# EAGLE design interface (EAGLE 9.4.2)
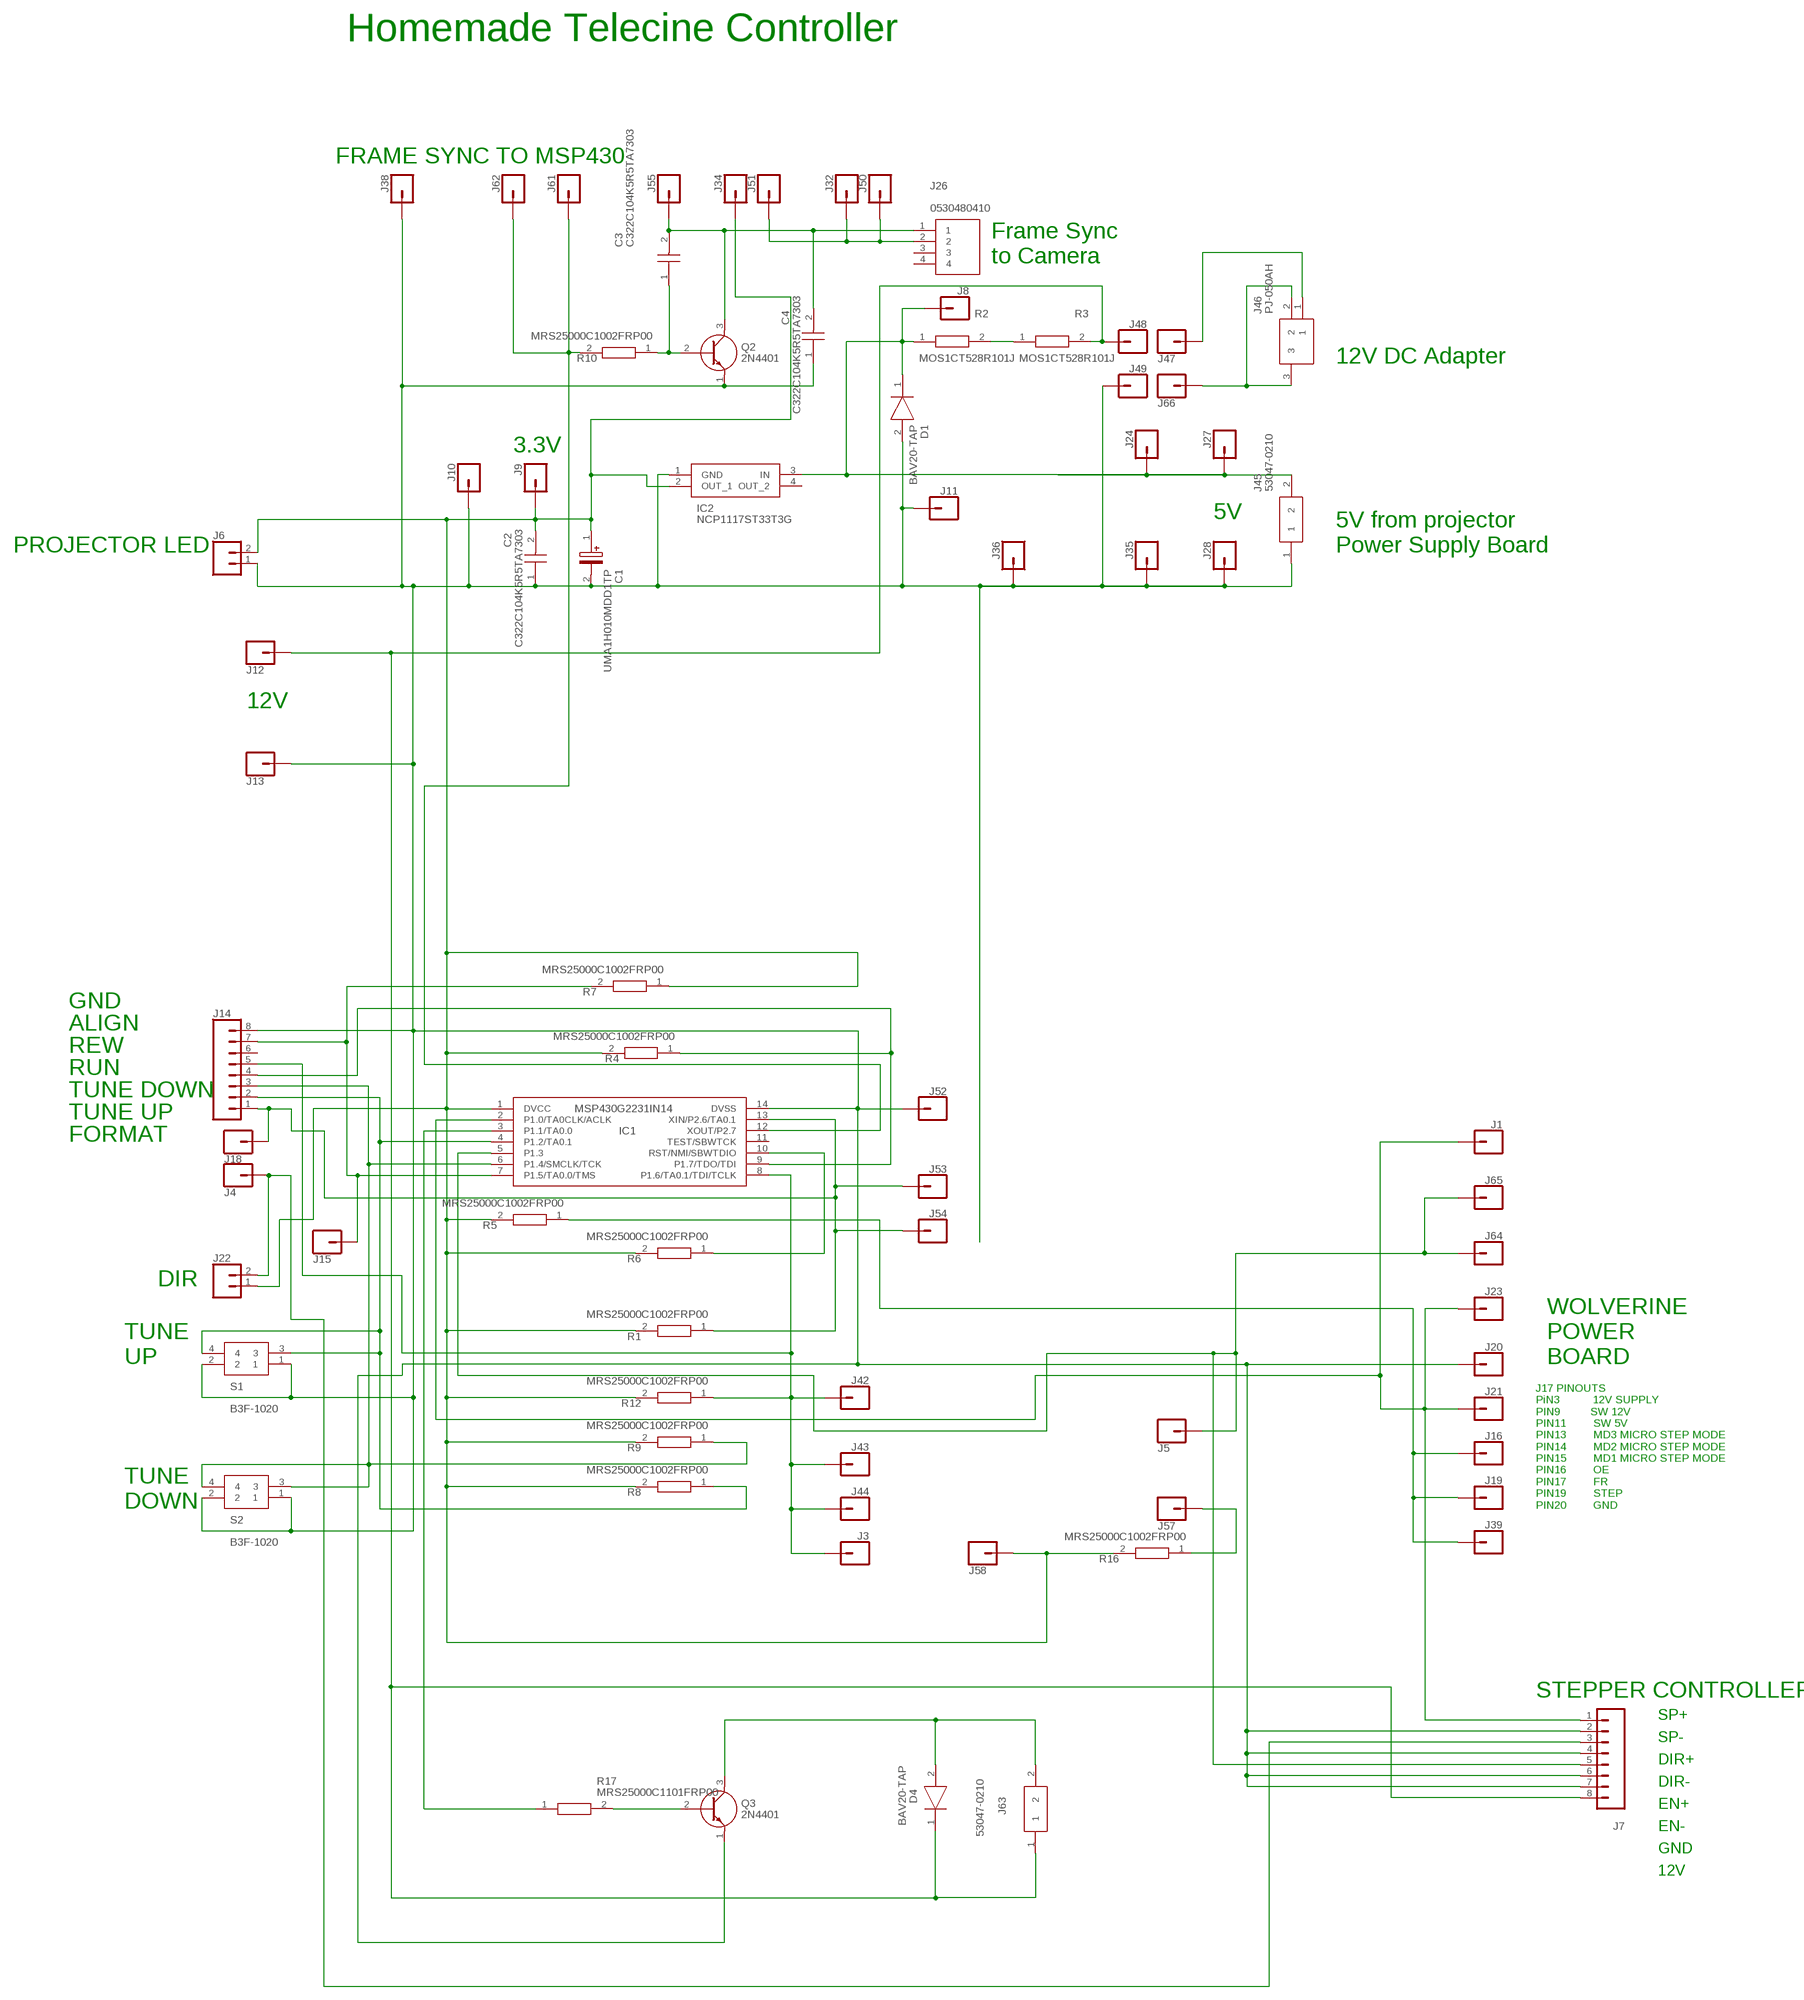
[diagram p0: schematic, sheet 1]

## Parts
C1  UMA1H010MDD1TP  [CAPPRD150W45D450H600]
C2  C322C104K5R5TA7303  [C322]
C3  C322C104K5R5TA7303  [C322]
C4  C322C104K5R5TA7303  [C322]
D1  BAV20-TAP  [DIOAD950W60L350D150]
D4  BAV20-TAP  [DIOAD950W60L350D150]
IC1  MSP430G2231IN14  [DIP254P762X508-14]
IC2  NCP1117ST33T3G  [SOT230P700X180-4N]
J1  CONN_01  [1X01]
J3  CONN_01  [1X01]
J4  CONN_01  [1X01]
J5  CONN_01  [1X01]
J6  CONN_02  [1X02]
J7  CONN_08"  [1X08]
J8  CONN_01  [1X01]
J9  CONN_01  [1X01]
J10  CONN_01  [1X01]
J11  CONN_01  [1X01]
J12  CONN_01  [1X01]
J13  CONN_01  [1X01]
J14  CONN_08"  [1X08]
J15  CONN_01  [1X01]
J16  CONN_01  [1X01]
J18  CONN_01  [1X01]
J19  CONN_01  [1X01]
J20  CONN_01  [1X01]
J21  CONN_01  [1X01]
J22  CONN_02  [1X02]
J23  CONN_01  [1X01]
J24  CONN_01  [1X01]
J26  0530480410  [SHDR4W35P0X125_1X4_675X550X350]
J27  CONN_01  [1X01]
J28  CONN_01  [1X01]
J32  CONN_01  [1X01]
J34  CONN_01  [1X01]
J35  CONN_01  [1X01]
J36  CONN_01  [1X01]
J38  CONN_01  [1X01]
J39  CONN_01  [1X01]
J42  CONN_01  [1X01]
J43  CONN_01  [1X01]
J44  CONN_01  [1X01]
J45  53047-0210  [53047-0210]
J46  PJ-050AH  [PJ050AH]
J47  CONN_01  [1X01]
J48  CONN_01  [1X01]
J49  CONN_01  [1X01]
J50  CONN_01  [1X01]
J51  CONN_01  [1X01]
J52  CONN_01  [1X01]
J53  CONN_01  [1X01]
J54  CONN_01  [1X01]
J55  CONN_01  [1X01]
J57  CONN_01  [1X01]
J58  CONN_01  [1X01]
J61  CONN_01  [1X01]
J62  CONN_01  [1X01]
J63  53047-0210  [53047-0210]
J64  CONN_01  [1X01]
J65  CONN_01  [1X01]
J66  CONN_01  [1X01]
Q2  2N4401  [CS_TO-92]
Q3  2N4401  [CS_TO-92]
R1  MRS25000C1002FRP00  [RESAD1650W60L650D250]
R2  MOS1CT528R101J  [RESAD2100W60L900D300]
R3  MOS1CT528R101J  [RESAD2100W60L900D300]
R4  MRS25000C1002FRP00  [RESAD1650W60L650D250]
R5  MRS25000C1002FRP00  [RESAD1650W60L650D250]
R6  MRS25000C1002FRP00  [RESAD1650W60L650D250]
R7  MRS25000C1002FRP00  [RESAD1650W60L650D250]
R8  MRS25000C1002FRP00  [RESAD1650W60L650D250]
R9  MRS25000C1002FRP00  [RESAD1650W60L650D250]
R10  MRS25000C1002FRP00  [RESAD1650W60L650D250]
R12  MRS25000C1002FRP00  [RESAD1650W60L650D250]
R16  MRS25000C1002FRP00  [RESAD1650W60L650D250]
R17  MRS25000C1101FRP00  [RESAD1650W60L650D250]
S1  B3F-1020  [B3F1000]
S2  B3F-1020  [B3F1000]

## Nets
N$1: C3.2 C4.2 J26.1 J55.1 Q2.3(C)
N$2: IC1.13(XIN/P2.6/TA0.1) J14.1 J18.1 J53.1 J54.1 R1.1
N$3: D4.1(K) J7.8 J12.1 J48.1 J63.1 R3.2
N$4: IC1.9(P1.7/TDO/TDI) J14.4 R4.1
N$5: J57.1 R16.1
N$6: C1.1(+) C2.2 IC1.1(DVCC) IC2.2(OUT_1) J6.2 J9.1 J22.1 J34.1 J58.1 R1.2 R4.2 R5.2 R6.2 R7.1 R8.2 R9.2 R12.2 R16.2
N$7: IC1.3(P1.1/TA0.0) R17.1
N$8: IC1.10(RST/NMI/SBWTDIO) R6.1
N$9: R2.2 R3.1
N$10: J4.1 J7.3 J22.2
N$11: D1.1(K) IC2.3(IN) J8.1 J24.1 J27.1 J45.2 R2.1
N$12: J46.1 J47.1
N$13: IC1.7(P1.5/TA0.0/TMS) J14.7 J15.1 R7.2
N$14: J16.1 J19.1 J39.1 R5.1
N$15: IC1.5(P1.3) J5.1 J7.5 J64.1 J65.1
N$16: IC1.2(P1.0/TA0CLK/ACLK) J1.1 J7.1 J21.1 J23.1
N$17: IC1.4(P1.2/TA0.1) J14.2 R8.1 S1.3 S1.4
N$19: C1.2(-) C2.1 C4.1 D1.2(A) IC1.14(DVSS) IC2.1(GND) J6.1 J7.2 J7.4 J7.6 J7.7 J10.1 J11.1 J13.1 J14.8 J20.1 J28.1 J35.1 J36.1 J38.1 J45.1 J49.1 J52.1 Q2.1(E) Q3.1(E) S1.1 S1.2 S2.1 S2.2
N$21: IC1.6(P1.4/SMCLK/TCK) J14.3 R9.1 S2.3 S2.4
N$22: IC1.12(XOUT/P2.7) J61.1 J62.1 R10.2
N$25: Q3.2(B) R17.2
N$27: C3.1 Q2.2(B) R10.1
N$28: J26.2 J32.1 J50.1 J51.1
N$30: IC1.8(P1.6/TA0.1/TDI/TCLK) J3.1 J14.5 J42.1 J43.1 J44.1 R12.1
N$31: J46.2 J46.3 J66.1
N$36: D4.2(A) J63.2 Q3.3(C)
Unconnected: IC1.11(TEST/SBWTCK) IC2.4(OUT_2) J14.6 J26.3 J26.4

## Notes on the sheet
- Homemade Telecine Controller
- FRAME SYNC TO MSP430
- Frame Sync 
  to Camera
- 12V DC Adapter
- 3.3V
- 5V
- PROJECTOR LED
- 5V from projector
  Power Supply Board
- 12V
- GND
- ALIGN
- REW
- RUN
- TUNE DOWN
- TUNE UP
- FORMAT
- DIR
- TUNE
  UP
- WOLVERINE
  POWER
  BOARD
- TUNE
  DOWN
- J17 PINOUTS
  PiN3           12V SUPPLY
  PIN9          SW 12V
  PIN11         SW 5V
  PIN13         MD3 MICRO STEP MODE         
  PIN14         MD2 MICRO STEP MODE
  PIN15         MD1 MICRO STEP MODE
  PIN16         OE
  PIN17         FR
  PIN19         STEP
  PIN20         GND
- STEPPER CONTROLLER
- SP+
- SP-
- DIR+
- DIR-
- EN+
- EN-
- GND
- 12V

## Library data of the parts
C1 = UMA1H010MDD1TP:UMA1H010MDD1TP: Aluminum Electrolytic Capacitors - Leaded 1uF 50 Volts 20% Source: Datasheet <https://www.mouser.com/ds/2/293/e-uma-1218975.pdf>; ALLIED_NUMBER: E4769760; ALLIED_PRICE-STOCK: https://www.alliedelec.com/nichicon-uma1h010mdd1tp/E4769760/; DESCRIPTION: Aluminum Electrolytic Capacitors - Leaded 1uF 50 Volts 20%; HEIGHT: 6mm; MANUFACTURER_NAME: Nichicon; MANUFACTURER_PART_NUMBER: UMA1H010MDD1TP; MOUSER_PART_NUMBER: 647-UMA1H010MDD1TP; MOUSER_PRICE-STOCK: https://www.mouser.com/Search/Refine.aspx?Keyword=647-UMA1H010MDD1TP
C2-C4 = C322C104K5R5TA7303:C322C104K5R5TA7303: Multilayer Ceramic Capacitors MLCC - Leaded 50volts 0.1uF 10% X7R Source: Datasheet <https://content.kemet.com/datasheets/KEM_C1050_GOLDMAX_X7R.pdf>; DESCRIPTION: Multilayer Ceramic Capacitors MLCC - Leaded 50volts 0.1uF 10% X7R; HEIGHT: mm; MANUFACTURER_NAME: Kemet; MANUFACTURER_PART_NUMBER: C322C104K5R5TA7303; MOUSER_PART_NUMBER: 80-C322C104K5R7303; MOUSER_PRICE-STOCK: https://www.mouser.com/Search/Refine.aspx?Keyword=80-C322C104K5R7303
D1 D4 = BAV20-TAP:BAV20-TAP: Diode Switching 200V 0.25A Vishay BAV20-TAP Switching Diode, 250mA 200V, 2-Pin DO-35 Source: Datasheet <https://componentsearchengine.com/Datasheets/1/BAV20-TAP.pdf>; DESCRIPTION: Diode Switching 200V 0.25A Vishay BAV20-TAP Switching Diode, 250mA 200V, 2-Pin DO-35; HEIGHT: mm; MANUFACTURER_NAME: Vishay; MANUFACTURER_PART_NUMBER: BAV20-TAP; MOUSER_PART_NUMBER: 78-BAV20-TAP; MOUSER_PRICE-STOCK: https://www.mouser.com/Search/Refine.aspx?Keyword=78-BAV20-TAP
IC1 = MSP430G2231IN14:MSP430G2231IN14: MSP430G2x21, MSP430G2x31 Mixed Signal Microcontroller Source: Datasheet <http://www.ti.com/lit/gpn/msp430g2231>; DESCRIPTION: MSP430G2x21, MSP430G2x31 Mixed Signal Microcontroller; HEIGHT: mm; MANUFACTURER_NAME: Texas Instruments; MANUFACTURER_PART_NUMBER: MSP430G2231IN14; MOUSER_PART_NUMBER: 595-MSP430G2231IN14; MOUSER_PRICE-STOCK: https://www.mouser.com/Search/Refine.aspx?Keyword=595-MSP430G2231IN14; RS_PART_NUMBER: 7244654P; RS_PRICE-STOCK: http://uk.rs-online.com/web/p/products/7244654P
IC2 = NCP1117ST33T3G:NCP1117ST33T3G: ON SEMICONDUCTOR - NCP1117ST33T3G - IC, LINEAR VOLTAGE REGULATOR Source: Datasheet <https://componentsearchengine.com/Datasheets/1/NCP1117ST33T3G.pdf>; DESCRIPTION: ON SEMICONDUCTOR - NCP1117ST33T3G - IC, LINEAR VOLTAGE REGULATOR; HEIGHT: 1.8mm; MANUFACTURER_NAME: ON Semiconductor; MANUFACTURER_PART_NUMBER: NCP1117ST33T3G; MOUSER_PART_NUMBER: 863-NCP1117ST33T3G; MOUSER_PRICE-STOCK: https://www.mouser.com/Search/Refine.aspx?Keyword=863-NCP1117ST33T3G
J1 J3-J5 J8-J13 J15 J16 J18-J21 J23 J24 J27 J28 J32 J34-J36 J38 J39 J42-J44 J47-J55 J57 J58 J61 J62 J64-J66 = SparkFun-Connectors:CONN_01: Single connection point. Often used as Generic Header-pin footprint for 0.1 inch spaced/style header connections On any of the 0.1 inch spaced packages, you can populate with these: Break Away Headers - Straight <https://www.sparkfun.com/products/116> (PRT-00116) Break Away Male Headers - Right Angle <https://www.sparkfun.com/products/553> (PRT-00553) Female Headers <https://www.sparkfun.com/products/115> (PRT-00115) Break Away Headers - Machine Pin <https://www.sparkfun.com/products/117> (PRT-00117) Break Away Female Headers - Swiss Machine Pin <https://www.sparkfun.com/products/743> (PRT-00743) This device is also useful as a general connection point to wire up your design to another part of your project. Our various solder wires solder well into these plated through hole pads. Hook-Up Wire - Assortment (Stranded, 22 AWG) <https://www.sparkfun.com/products/11375> (PRT-11375) Hook-Up Wire - Assortment (Solid Core, 22 AWG) <https://www.sparkfun.com/products/11367> (PRT-11367) View the entire wire category on our website here <https://www.sparkfun.com/categories/141> Special notes: SMTSO-256-ET is a "flush mount" nut for a 4-40 screw. We mostly use this on specialty testbeds; it is a nice way to connect hardware to your PCB at an adjustable hieght. Also note, the SNAP packages are for using a snappable style connector. We sell a baggie of snaps and they are also used on two LilyPad designs: Snap Assortment - 30 pack (male and female) <https://www.sparkfun.com/products/11347> (DEV-11347) LilyPad Arduino SimpleSnap <https://www.sparkfun.com/products/10941> (DEV-10941) LilyPad SimpleSnap Protoboard <https://www.sparkfun.com/products/10940> (DEV-10940)
J6 J22 = SparkFun-Connectors:CONN_02: Multi connection point. Often used as Generic Header-pin footprint for 0.1 inch spaced/style header connections On any of the 0.1 inch spaced packages, you can populate with these: Break Away Headers - Straight <https://www.sparkfun.com/products/116> (PRT-00116) Break Away Male Headers - Right Angle <https://www.sparkfun.com/products/553> (PRT-00553) Female Headers <https://www.sparkfun.com/products/115> (PRT-00115) Break Away Headers - Machine Pin <https://www.sparkfun.com/products/117> (PRT-00117) Break Away Female Headers - Swiss Machine Pin <https://www.sparkfun.com/products/743> (PRT-00743) For SCREWTERMINALS and SPRING TERMINALS visit here: Screw Terimnals on SparkFun.com <https://www.sparkfun.com/search/results?term=Screw+Terminals> (5mm/3.5mm/2.54mm spacing) This device is also useful as a general connection point to wire up your design to another part of your project. Our various solder wires solder well into these plated through hole pads. Hook-Up Wire - Assortment (Stranded, 22 AWG) <https://www.sparkfun.com/products/11375> (PRT-11375) Hook-Up Wire - Assortment (Solid Core, 22 AWG) <https://www.sparkfun.com/products/11367> (PRT-11367) View the entire wire category on our website here <https://www.sparkfun.com/categories/141> Special notes: Molex polarized connector foot print use with: PRT-08233 with associated crimp pins and housings. 2.54_SCREWTERM for use with PRT-10571. 3.5mm Screw Terminal footprints for PRT-08084 5mm Screw Terminal footprints for use with PRT-08432
J7 J14 = SparkFun-Connectors:CONN_08: Multi connection point. Often used as Generic Header-pin footprint for 0.1 inch spaced/style header connections On any of the 0.1 inch spaced packages, you can populate with these: Break Away Headers - Straight <https://www.sparkfun.com/products/116> (PRT-00116) Break Away Male Headers - Right Angle <https://www.sparkfun.com/products/553> (PRT-00553) Female Headers <https://www.sparkfun.com/products/115> (PRT-00115) Break Away Headers - Machine Pin <https://www.sparkfun.com/products/117> (PRT-00117) Break Away Female Headers - Swiss Machine Pin <https://www.sparkfun.com/products/743> (PRT-00743) Arduino Stackable Header - 8 Pin <https://www.sparkfun.com/products/9279> (PRT-09279) For SCREWTERMINALS and SPRING TERMINALS visit here: Screw Terimnals on SparkFun.com <https://www.sparkfun.com/search/results?term=Screw+Terminals> (5mm/3.5mm/2.54mm spacing) This device is also useful as a general connection point to wire up your design to another part of your project. Our various solder wires solder well into these plated through hole pads. Hook-Up Wire - Assortment (Stranded, 22 AWG) <https://www.sparkfun.com/products/11375> (PRT-11375) Hook-Up Wire - Assortment (Solid Core, 22 AWG) <https://www.sparkfun.com/products/11367> (PRT-11367) View the entire wire category on our website here <https://www.sparkfun.com/categories/141> Special notes: Molex polarized connector foot print use with SKU : PRT-08231 with associated crimp pins and housings. 1MM SMD Version SKU: PRT-10208 NOTES ON THE VARIANTS LOCK and LOCK_LONGPADS... This footprint was designed to help hold the alignment of a through-hole component (i.e. 6-pin header) while soldering it into place. You may notice that each hole has been shifted either up or down by 0.005 of an inch from it's more standard position (which is a perfectly straight line). This slight alteration caused the pins (the squares in the middle) to touch the edges of the holes. Because they are alternating, it causes a "brace" to hold the component in place. 0.005 has proven to be the perfect amount of "off-center" position when using our standard breakaway headers. Although looks a little odd when you look at the bare footprint, once you have a header in there, the alteration is very hard to notice. Also,if you push a header all the way into place, it is covered up entirely on the bottom side.; PROD_ID: CONN-08438
J26 = 0530480410:0530480410: MOLEX - 0530480410 - PicoBlade WIRE-BOARD CONNECTOR HEADER 4 POSITION, 1.25MM Source: Datasheet <https://www.arrow.com/en/products/0530480410/molex>; ARROW_PART_NUMBER: 0530480410; ARROW_PRICE-STOCK: https://www.arrow.com/en/products/0530480410/molex; DESCRIPTION: MOLEX - 0530480410 - PicoBlade WIRE-BOARD CONNECTOR HEADER 4 POSITION, 1.25MM; HEIGHT: 3.5mm; MANUFACTURER_NAME: Molex; MANUFACTURER_PART_NUMBER: 0530480410
J45 J63 = 53047-0210:53047-0210: 2 way through board PCB straight header Molex PICOBLADE Series, Series Number 53047, 1.25mm Pitch 2 Way 1 Row Straight PCB Header, Solder Termination, 1A Source: Datasheet <http://uk.rs-online.com/web/p/products/2799213P>; DESCRIPTION: 2 way through board PCB straight header Molex PICOBLADE Series, Series Number 53047, 1.25mm Pitch 2 Way 1 Row Straight PCB Header, Solder Termination, 1A; HEIGHT: mm; MANUFACTURER_NAME: Molex; MANUFACTURER_PART_NUMBER: 53047-0210; RS_PART_NUMBER: 2799213P; RS_PRICE-STOCK: http://uk.rs-online.com/web/p/products/2799213P
J46 = PJ-050AH:PJ-050AH: DC Power Connectors Power Jacks Source: Datasheet <https://www.cui.com/product/resource/pj-050ah.pdf>; ARROW_PART_NUMBER: PJ-050AH; ARROW_PRICE-STOCK: https://www.arrow.com/en/products/pj-050ah/cui-devices; DESCRIPTION: DC Power Connectors Power Jacks; HEIGHT: 11mm; MANUFACTURER_NAME: CUI Inc.; MANUFACTURER_PART_NUMBER: PJ-050AH; MOUSER_PART_NUMBER: 490-PJ-050AH; MOUSER_PRICE-STOCK: https://www.mouser.co.uk/ProductDetail/CUI-Devices/PJ-050AH?qs=WyjlAZoYn50PwROH2sG8CQ%3D%3D
Q2 Q3 = 2N4401:2N4401: Bipolar Transistors - BJT NPN Gen Pur SS Source: Datasheet <https://my.centralsemi.com/get_document.php?cmp=1&mergetype=pd&mergepath=pd&pdf_id=2N4400.PDF>; DESCRIPTION: Bipolar Transistors - BJT NPN Gen Pur SS; HEIGHT: mm; MANUFACTURER_NAME: Central Semiconductor; MANUFACTURER_PART_NUMBER: 2N4401; MOUSER_PART_NUMBER: 610-2N4401; MOUSER_PRICE-STOCK: https://www.mouser.com/Search/Refine.aspx?Keyword=610-2N4401
R1 R4-R10 R12 R16 = SamacSys_Parts:MRS25000C1002FRP00: Vishay MRS25 Series RP Axial Metal Film Resistor 10k +/-1% 0.6W +/-50ppm/K Source: Datasheet <https://componentsearchengine.com/Datasheets/1/MRS25000C1002FRP00.pdf>; DESCRIPTION: Vishay MRS25 Series RP Axial Metal Film Resistor 10k +/-1% 0.6W +/-50ppm/K; HEIGHT: mm; MANUFACTURER_NAME: Vishay; MANUFACTURER_PART_NUMBER: MRS25000C1002FRP00; MOUSER_PART_NUMBER: 594-MRS2510K00F; MOUSER_PRICE-STOCK: https://www.mouser.com/Search/Refine.aspx?Keyword=594-MRS2510K00F
R2 R3 = SamacSys_Parts:MOS1CT528R101J: Metal Oxide Resistors 100 ohm 5% 1W Source: Datasheet <https://componentsearchengine.com/Datasheets/1/MOS1CT528R101J.pdf>; DESCRIPTION: Metal Oxide Resistors 100 ohm 5% 1W; HEIGHT: mm; MANUFACTURER_NAME: KOA Speer; MANUFACTURER_PART_NUMBER: MOS1CT528R101J; MOUSER_PART_NUMBER: 660-MOS1CT528R101J; MOUSER_PRICE-STOCK: https://www.mouser.com/Search/Refine.aspx?Keyword=660-MOS1CT528R101J
R17 = MRS25000C1101FRP00:MRS25000C1101FRP00: Vishay MRS2500 Series Axial Metal Film Resistor 1.1k +/-1% 0.6W +/-50ppm/K Source: Datasheet <https://componentsearchengine.com/Datasheets/1/MRS25000C1101FRP00.pdf>; DESCRIPTION: Vishay MRS2500 Series Axial Metal Film Resistor 1.1k +/-1% 0.6W +/-50ppm/K; HEIGHT: mm; MANUFACTURER_NAME: Vishay; MANUFACTURER_PART_NUMBER: MRS25000C1101FRP00; MOUSER_PART_NUMBER: 594-MRS25000C1101FRP; MOUSER_PRICE-STOCK: https://www.mouser.com/Search/Refine.aspx?Keyword=594-MRS25000C1101FRP
S1 S2 = B3F-1020:B3F-1020: Switch Tact SPST,flat 5mm act,PC Pins Black Plunger Tactile Switch, SPST-NO 0.05 A@ 24 V dc 0.9mm Source: Datasheet <http://www.omron.com/ecb/products/pdf/en-b3f.pdf>; DESCRIPTION: Switch Tact SPST,flat 5mm act,PC Pins Black Plunger Tactile Switch, SPST-NO 0.05 A@ 24 V dc 0.9mm; HEIGHT: mm; MANUFACTURER_NAME: Omron Electronics; MANUFACTURER_PART_NUMBER: B3F-1020; MOUSER_PART_NUMBER: 653-B3F-1020; MOUSER_PRICE-STOCK: https://www.mouser.co.uk/ProductDetail/Omron-Electronics/B3F-1020?qs=lK7M36XCk6J1%2FfWxwEHrqA%3D%3D

## Board
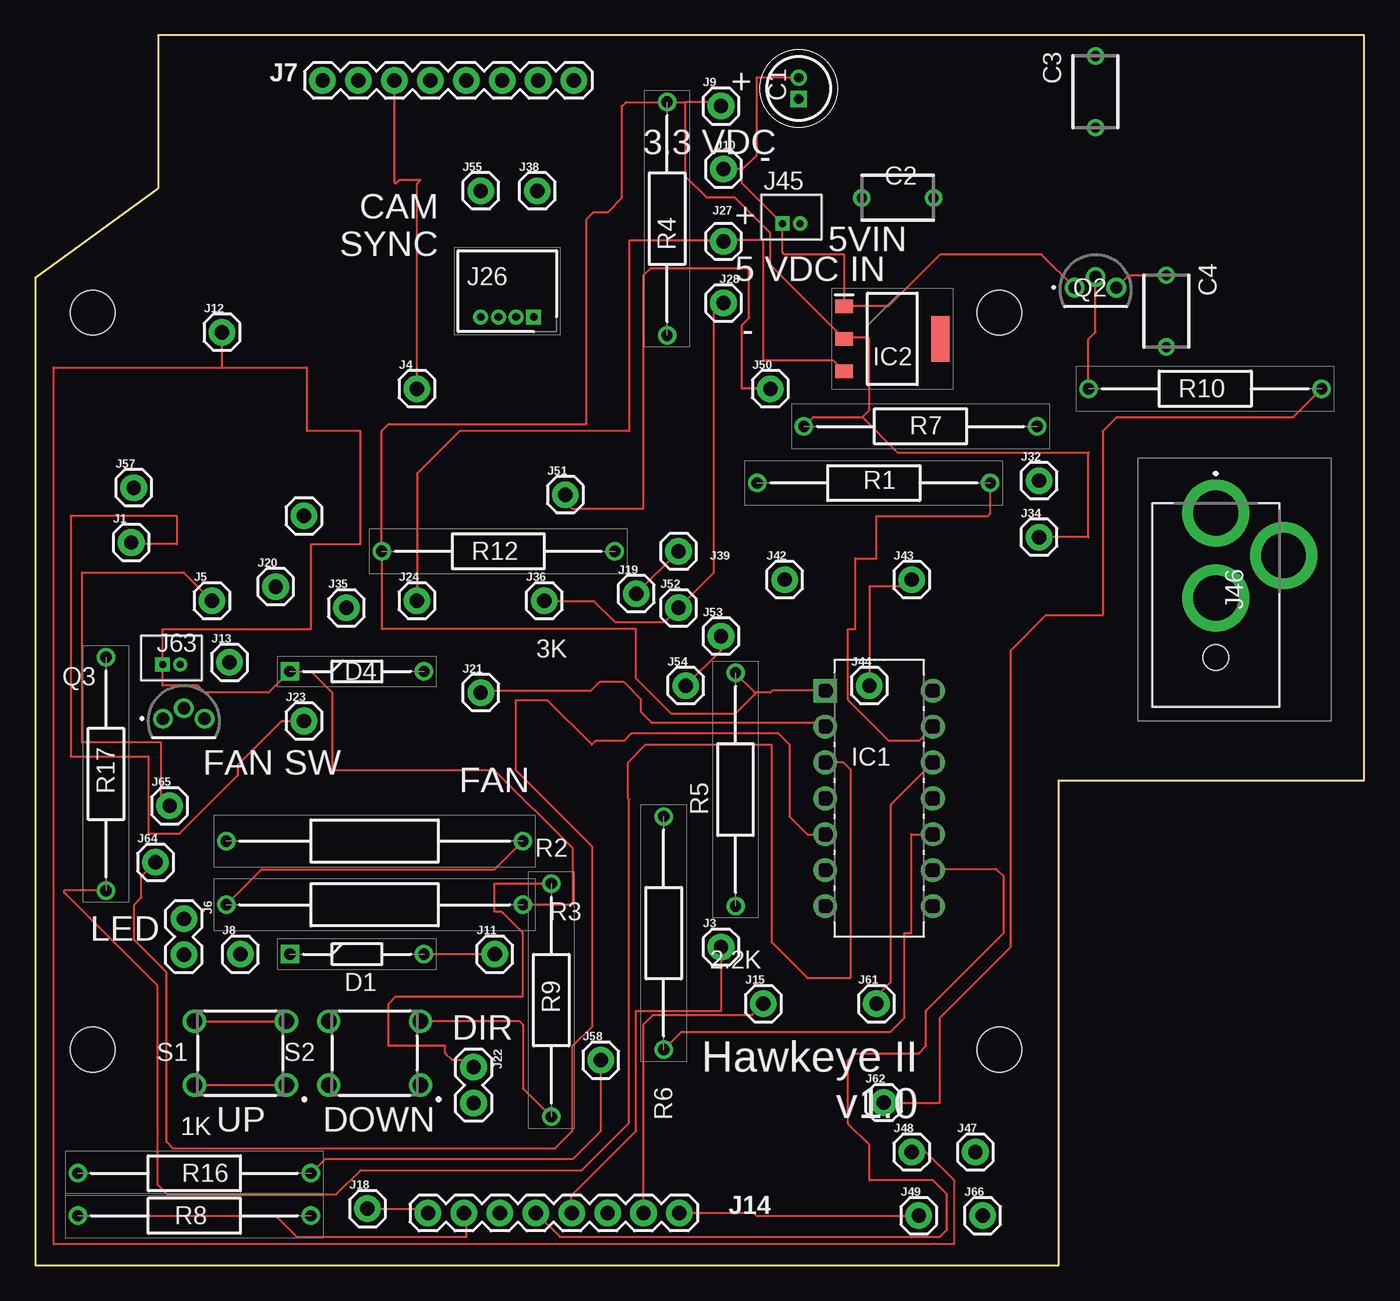
[diagram p1: board, top side]
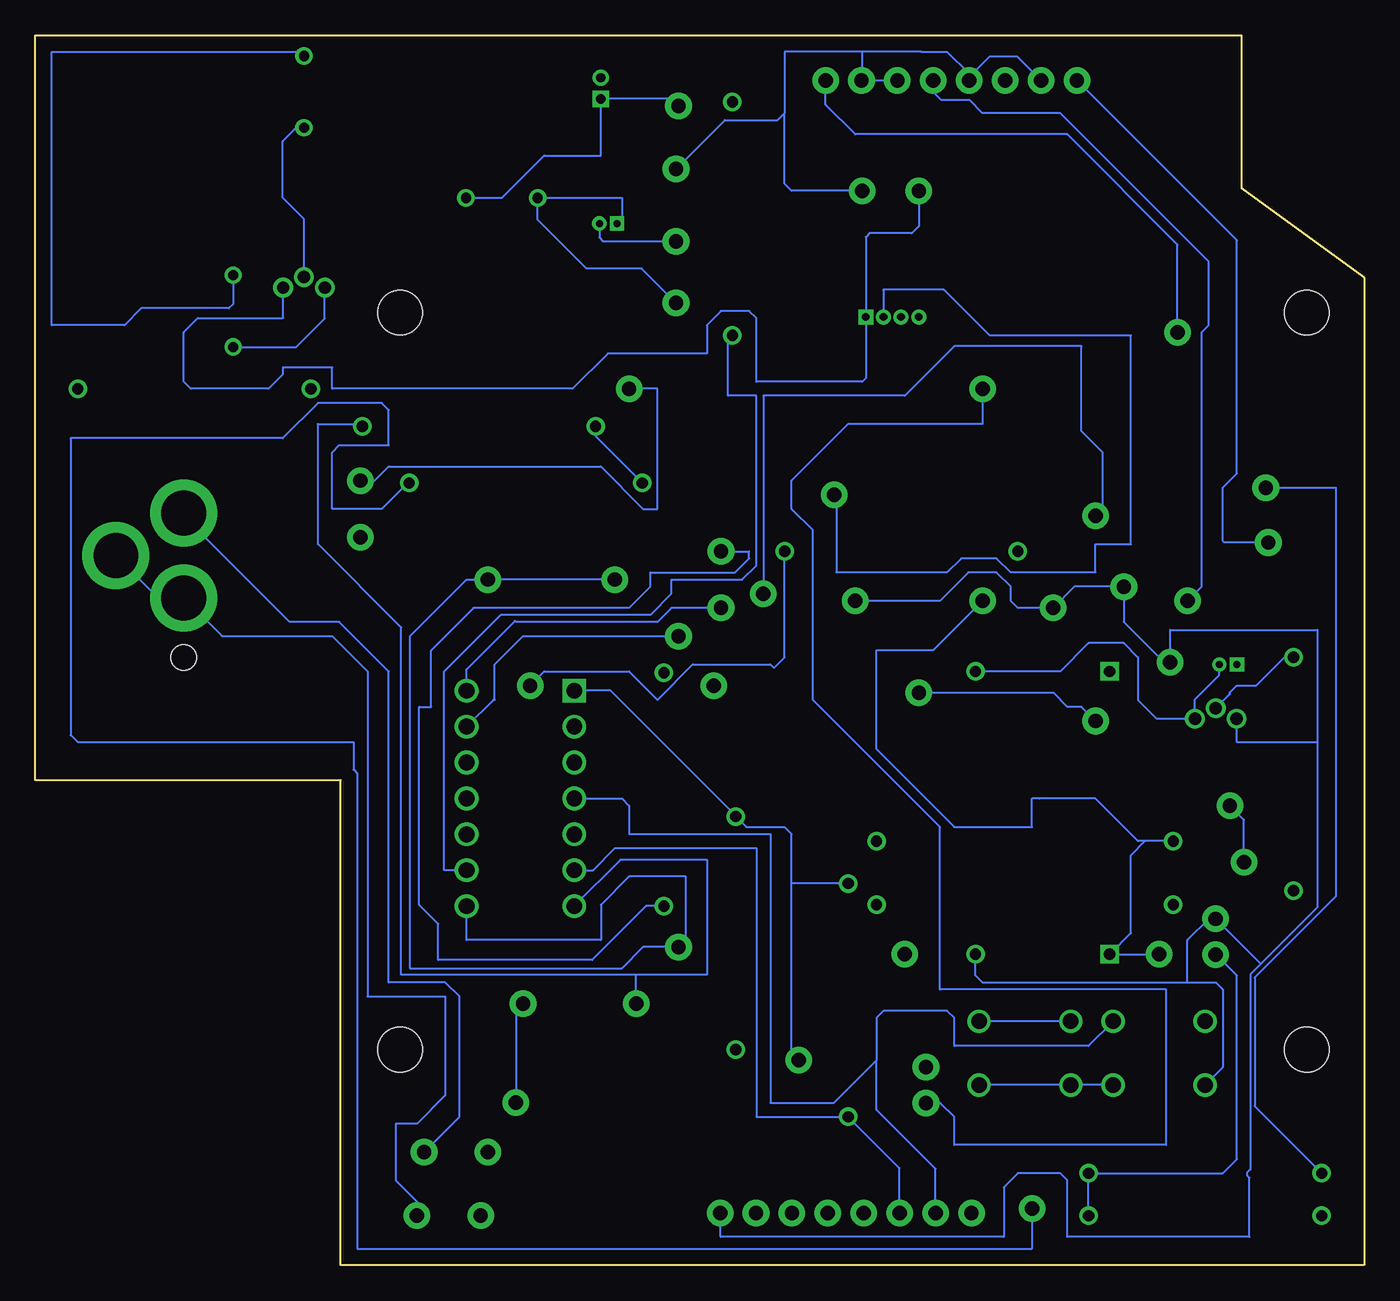
[diagram p2: board, bottom side, seen from below]

Size 94 x 87 mm. Coordinates in mm from the lower left corner, seen from the top.
Outline: 72.39,0 72.39,34.29 94,34.29 94,87 8.69,87 8.69,76.2 0,69.85 0,0 72.39,0
Copper layers (1*16): Top 0.035mm / dielectric 1.5mm / Bottom 0.035mm
Design rules "default": minimum track width 6mil, minimum drill 0.35mm, track to track 6mil, track to pad 6mil, pad to pad 6mil, via to via 6mil, smd to smd 6mil, copper to edge 40mil, drill to drill 6mil, minimum pad ring 10mil, minimum via ring 8mil, stop-mask expansion 4mil, vias tented up to drill 0mil, thermal gap 10mil
Holes 3.17 mm at 4.06,15.24 68.2,15.24 68.2,67.39 4.06,67.39

### Footprints (pad centres in the part's own frame; a part is rotated, then mirrored left to right if it is on the bottom)
CAPPRD150W45D450H600 = drill 0.65 pad 1.05 square: 1 0,0 | drill 0.65 pad 1.05: 2 1.5,0
C322 = drill 0.71 pad 1.21: 1 -2.54,0; 2 2.54,0
DIOAD950W60L350D150 = drill 0.8 pad 1.2 square: 1 0,0 | drill 0.8 pad 1.2: 2 9.5,0
DIP254P762X508-14 = drill 1.118 pad 1.676 square: 1 -7.62,15.24 | drill 1.118 pad 1.676: 2 -7.62,12.7; 3 -7.62,10.16; 4 -7.62,7.62; 5 -7.62,5.08; 6 -7.62,2.54; 7 -7.62,0; 8 0,0; 9 0,2.54; 10 0,5.08; 11 0,7.62; 12 0,10.16; 13 0,12.7; 14 0,15.24
SOT230P700X180-4N = smd 1.25 x 0.95: 1 -3.4,2.3; 2 -3.4,0; 3 -3.4,-2.3 | smd 1.25 x 3.2: 4 3.4,0
1X01 = drill 1.016 pad 1.88: 1 0,0
1X02 = drill 1.016 pad 1.88: 1 0,0; 2 2.54,0
1X08 = drill 1.016 pad 1.88: 1 0,0; 2 2.54,0; 3 5.08,0; 4 7.62,0; 5 10.16,0; 6 12.7,0; 7 15.24,0; 8 17.78,0
SHDR4W35P0X125_1X4_675X550X350 = drill 0.55 pad 0.95 square: 1 0,0 | drill 0.55 pad 0.95: 2 -1.25,0; 3 -2.5,0; 4 -3.75,0
53047-0210 = drill 0.5 pad 1 square: 1 0,0 | drill 0.5 pad 1: 2 -1.25,0
PJ050AH = drill 3.162 pad 4.743: 1 13.7,0; 2 7.7,0; 3 10.7,-4.8 | hole 1.8: 3.5,0
CS_TO-92 = drill 0.88 pad 1.35: 1 -1.47,-2.35 | drill 0.88 pad 1.4: 2 0,-1.6; 3 1.47,-2.35
RESAD1650W60L650D250 = drill 0.8 pad 1.2: 1 0,0; 2 16.5,0
RESAD2100W60L900D300 = drill 0.8 pad 1.2: 1 0,0; 2 21,0
B3F1000 = drill 1.1 pad 1.65: 1 3.25,-2.25; 2 -3.25,-2.25; 3 3.25,2.25; 4 -3.25,2.25

### Placement (x,y rotation side)
C1  54,82.5 90 top
C2  61,75.5 0 top
C3  75,83 90 top
C4  80,67.5 90 top
D1  18,22 0 top
D4  18,42 0 top
IC1  63.5,25.4 0 top
IC2  60.62,65.53 0 top
J1  6.78,51.12 0 top
J3  48.5,22.5 0 top
J4  27,62 0 top
J5  12.5,47 0 top
J6  10.5,24.5 270 top
J7  20.32,83.82 0 top
J8  14.5,22 0 top
J9  48.5,82 0 top
J10  48.68,77.54 0 top
J11  32.5,22 0 top
J12  13.21,66 0 top
J13  13.74,42.64 0 top
J14  27.78,3.7 0 top
J15  51.5,18.5 0 top
J16  19,53 0 top
J18  23.5,4 0 top
J19  42.5,47.5 0 top
J20  17,48 0 top
J21  31.5,40.5 0 top
J22  31,14 270 top
J23  19,38.5 0 top
J24  27,47 0 top
J26  35.26,67.08 0 top
J27  48.68,72.42 0 top
J28  48.68,68.07 0 top
J32  71,55.5 0 top
J34  71,51.5 0 top
J35  22,46.5 0 top
J36  36,47 0 top
J38  35.5,76 0 top
J39  45.5,50.5 0 top
J42  53,48.5 0 top
J43  62,48.5 0 top
J44  59,41 0 top
J45  52.85,73.69 180 top
J46  83.5,39.5 90 top
J47  66.5,8 0 top
J48  62,8 0 top
J49  62.5,3.5 0 top
J50  52,62 0 top
J51  37.5,54.5 0 top
J52  45.5,46.5 0 top
J53  48.5,44.5 0 top
J54  46,41 0 top
J55  31.5,76 0 top
J57  6.96,55 0 top
J58  40,14.5 0 top
J61  59.5,18.5 0 top
J62  60,11.5 0 top
J63  9,42.5 180 top
J64  8.5,28.5 0 top
J65  9.5,32.5 0 top
J66  67,3.5 0 top
Q2  75,71.5 0 top
Q3  10.5,41 0 top
R1  67.56,55.33 180 top
R2  13.5,30 0 top
R3  13.5,25.5 0 top
R4  44.69,65.78 90 top
R5  49.53,25.4 90 top
R6  44.45,15.24 90 top
R7  54.37,59.34 0 top
R8  3,3.5 0 top
R9  36.5,10.5 90 top
R10  74.5,62 0 top
R12  41,50.5 180 top
R16  3,6.5 0 top
R17  5,26.5 90 top
S1  14.5,15 0 top
S2  24,15 0 top

### Tracks (layer width: path | path; a pad name or v marks a point on that pad's centre or on a via)
N$1
  Top 0.152: Q2.3 77.36,70.04 C4.2
  Bottom 0.152: C4.2 80,68 80.31,67.69 86.5,67.69 87.69,66.5 92.83,66.5 92.83,85.83 75.29,85.83 C3.2 | Q2.3 76.47,67.03 76.5,67 82.5,67 83.5,66 83.5,62.5 83,62 77.5,62 76.5,63 76.5,63.5 73,63.5 73,62 56,62 53.5,64.5 46.5,64.5 46.5,66.5 45.5,67.5 43.5,67.5 43,67 43,62.5 35.5,62.5 35.26,62.74 J26.1 35.26,72.74 35,73 32,73 31.5,73.5 J55.1
N$2
  Top 0.152: IC1.13 62.5,37.1 60.4,37.1 57.5,40 57.5,45 58,45 58,50 59.5,50 59.5,53 67.39,53 67.56,53.17 R1.1 | J53.1 48.5,43.5 J54.1 | J18.1 27.48,4 J14.1
  Bottom 0.152: IC1.13 61.6,40 61.5,40 61.5,42.5 59.5,44.5 J53.1 | R1.1 67.67,55.33 69.5,53.5 73,53.5 73,57.5 72.5,58 69,58 69,60.5 69.5,61 74,61 76.5,58.5 91.5,58.5 91.5,37.5 91,37 71.5,37 71.5,35.05 71.22,34.77 71.22,1.17 23.5,1.17 J18.1
N$3
  Top 0.152: 13.21,63.5 J12.1 | 13.21,63.5 19.21,63.5 19.21,59 23,59 23,51 19.5,51 19.5,45 9,45 J63.1 9,41 11.5,41 12,40.5 16.5,40.5 D4.1 19.5,42 21,40.5 21,35 32.5,35 38,29.5 38,25.5 R3.2 | J48.1 63,8 65,6 65,1.5 1.27,1.5 1.27,63.5 13.21,63.5
  Bottom 0.152: J12.1 13.21,72.21 21,80 36,80 38.1,82.1 J7.8
N$4
  Top 0.152: J14.4 37.1,2 64,2 64.5,2.5 64.5,5 63.5,6 59,6 59,8.5 57.5,10 57.5,14.5 58,15 62.5,15 63,15.5 63,18 68.5,23.5 68.5,27.5 68,28 63.56,28 IC1.9
  Bottom 0.152: IC1.9 65.08,27.94 65.08,42 61.08,46 50.5,46 49,47.5 49,48.5 44,48.5 43,49.5 43,61.5 45,61.5 45,65.47 R4.1
N$5
  Bottom 0.152: J57.1 2,55 2,26.09 7.74,20.35 7.74,11.24 R16.1
N$6
  Top 0.152: IC2.2 57.12,65.62 | 57.12,65.62 52,70.75 52,73 49.5,75.5 47.5,75.5 46,77 46,82.28 | R7.1 55.03,60 58.5,60 | 58.5,60 59,60.5 59,65.5 58.88,65.62 57.12,65.62 | 58.5,60 61,57.5 74.5,57.5 74.5,51.5 J34.1 | R5.2 49.5,41.9 50.9,40.5 51,40.5 | IC1.1 52.14,40.64 52,40.5 51,40.5 | 51,40.5 49.5,39 45,39 42.5,41.5 42.5,45 24.5,45 R12.2 24.5,59 25,59.5 39,59.5 39,74 39.5,74.5 40.5,74.5 41.5,75.5 41.5,82 41.78,82.28 R4.2 46,82.28 | R16.2 20.5,7.5 38,7.5 40,9.5 J58.1 | 46,82.28 48.29,82.28 48.29,82.21 J9.1 | R9.2 32.5,27 32.5,25 33,25 34.5,23.5 34.5,19 25.5,19 25,18.5 25,15.5 29,15.5 29,15 29.5,14.5 30.5,14.5 J22.1
  Bottom 0.152: IC1.1 53.3,40.64 44.45,31.79 R6.2 43.71,31 41,31 40.5,30.5 40.5,27 | R7.1 54.37,58.64 R1.2 | 40.5,27 40.5,15 J58.1 | C2.2 61,75.5 58,78.5 54,78.5 C1.1 49,82.5 J9.1 | J6.2 10.46,21.96 9,20.5 9,7.5 10,6.5 R16.2 R8.2 | R9.2 40.5,27
N$7
  Top 0.152: IC1.3 57.15,35.56 57.69,35.02 57.69,20.32 54.61,20.32 52.07,22.86 52.07,36.83 43.18,36.83 41.91,35.56 41.91,33.02 42,32.93 42,10.08 38.64,6.71 23,6.71 21.29,5 9.34,5 8.62,5.71 8.62,19.78 2.04,26.36 2.04,26.5 R17.1
N$8
  Top 0.152: R6.1 45.72,16.51 60.5,16.51 61.49,17.5 61.49,23.5 61.5,23.5 61.96,23.5 61.96,30.48 IC1.10
N$9
  Top 0.152: R3.1 16,28 32.5,28 R2.2
N$10
  Top 0.152: J4.1 27,76.5 27.25,76.75 25.75,76.75 25.5,76.5 25.4,76.6 J7.3
  Bottom 0.152: J4.1 27,59.5 36.5,59.5 40.5,55.5 40.5,53.5 39,52 39,40 30,31 30,19.5 14,19.5 14,8.5 29,8.5 29,10.5 29.96,11.46 J22.2
N$11
  Top 0.152: IC2.3 56.45,64 51.5,64 51.5,72.5 48.76,72.5 J27.1 48.6,72.5 42,72.5 42,59 30,59 27,56 J24.1
  Bottom 0.152: J45.2 54.1,72.69 53.83,72.42 J27.1 | 15.5,30 16.5,29 16.5,23.5 D1.1 J8.1 | R2.1 15.5,30 | 15.5,30 16,30 19,33 23,33 23.5,33 23.5,31 29,31 34.5,36.5 34.5,43.5 30.5,43.5 J24.1
N$12
  Bottom 0.152: J47.1 64,10.5 64,19 65,20 69,20 69,42 72.5,45.5 76,45.5 83.5,53 J46.1
N$13
  Top 0.152: J14.7 43.02,16.98 43,17 43.7,17.7 50.7,17.7 J15.1
  Bottom 0.152: IC1.7 52.61,28.67 46.49,28.67 46.49,20.55 51.5,20.55 | 51.5,20.55 68.12,20.55 68.12,45.12 74,51 74,59.5 71.03,59.5 R7.2 | J15.1 51.5,20.55
N$14
  Top 0.152: J19.1 J39.1
  Bottom 0.152: R5.1 50.8,25.4 54.61,21.59 65.5,21.59 65.5,24.15 66.85,25.5 66.85,39.5 66,39.5 66,43.5 63,46.5 52,46.5 50.5,48 50.5,49 44.5,49 43.5,50 43.5,50.5 J39.1 | J16.1 18.5,53.5 18.5,57.5 20,59 20,65 29,65 32.5,61.5 42.5,61.5 J19.1
N$15
  Top 0.152: IC1.5 54.61,30.48 53.34,31.75 53.34,36.83 52.57,37.6 42.15,37.6 41.63,37.08 39.62,37.08 39.37,36.83 36.25,39.95 34,39.95 34,35 39.41,29.59 39.41,16.91 38,15.5 38,9.5 36.75,8.25 30.75,8.25 30.73,8.23 9.77,8.23 9.28,8.72 9.28,20.72 7,23 7,25.5 7.5,26 7.5,27.5 J64.1 | J65.1 8.88,33.12 8.88,37 3.31,37 3.31,49 10.5,49 J5.1
  Bottom 0.152: J64.1 8.5,31.5 J65.1 | J5.1 11.5,48 11.5,66 11,66.5 11,71 21.5,81.5 27,81.5 27.94,82.44 29.94,82.44 30.48,82.98 J7.5
N$16
  Top 0.152: IC1.2 55.61,38.37 43.63,38.37 42.85,39.15 42.85,40.03 41.63,41.25 39.9,41.25 39.3,40.64 31.64,40.64 J21.1 | J23.1 17.43,38.5 14.32,35.4 14.32,34.64 10.18,30.5 8,30.5 8,36 2.5,36 2.5,53 10,53 10,51 6.9,51 J1.1
  Bottom 0.152: J23.1 20,39.5 21,39.5 22,40.5 J21.1 | J1.1 9.88,51.12 10,51.24 10,55 9,56 9,72.5 J7.1
N$17
  Top 0.152: S1.4 S1.3 | R8.1 17,3.5 18.5,2 30.5,2 30.5,3.52 J14.2
  Bottom 0.152: IC1.4 55.86,33 52.5,33 52,32.5 52,30.5 42,30.5 42,11.5 37.5,11.5 34.5,14.5 | S1.3 19.5,15.5 29,15.5 29,17.5 29.5,18 34,18 34.5,17.5 34.5,14.5 | J14.2 30.32,6.82 34.5,11 34.5,14.5
N$19
  Top 0.152: Q2.1 71.18,71.5 64,71.5 60.33,67.83 57.39,67.83 57.22,68 | IC2.1 57.22,68 | 57.22,68 57.22,71.5 53,71.5 52.85,71.65 J45.1 50,76.54 50,77.54 | C1.2 51,84 51,78.5 50.04,77.54 50,77.54 | J28.1 48,67.39 48,49 J52.1 44.5,45.5 41,45.5 39.5,47 J36.1 | 50,77.54 J10.1 | J14.8 50.8,3.7 51,3.5 J49.1 | J11.1 D1.2 | S1.2 S1.1
  Bottom 0.152: IC1.14 63.5,42.14 60.07,45.57 60,45.5 50,45.5 49,46.5 J52.1 | 3.31,37 3.31,44.95 13.74,44.95 J13.1 14.14,42.64 17,45.5 J20.1 20.5,48 J35.1 24.5,46.5 25,47 25,48 26,49 28,49 30,47 J36.1 | 3.31,37 3.31,25.32 7.32,21.32 | C4.1 75.54,64.96 73.53,66.97 Q2.1 | Q3.1 9.03,37.03 9,37 3.31,37 | J10.1 45.22,81 41.5,81 41,81.5 | 41,81.5 41,85.83 35.5,85.83 | 7.32,21.32 J6.1 11,24.5 12.5,23 12.5,20 | D1.2 27.5,20.5 27,20 12.5,20 | J14.8 45.56,2.06 45.5,2 25.5,2 25.5,5.5 24.5,6.5 21.5,6.5 21,6 21,2 8.12,2 8.12,6.19 8.25,6.32 8.25,6.58 8.05,6.78 8.05,20.58 7.32,21.32 | J28.1 51.11,70.5 55,70.5 58.46,73.96 C2.1 52.5,75.5 52.5,74.04 J45.1 | 35.5,85.83 31.33,85.83 29.5,85.83 27.94,84.27 27.94,84.06 | J38.1 40.5,76 41,76.5 41,81.5 | S2.1 S2.2 S1.1 | 12.5,20 10.5,20 10,19.5 10,14 S1.2 | 35.5,85.83 35.5,83.88 J7.7 J7.6 | J7.2 24.54,85.5 26.5,85.5 27.94,84.06 | 27.94,84.06 27.94,84 J7.4
N$21
  Top 0.152: R9.1 34.5,12.5 34.5,17 34.25,17.25 S2.3
  Bottom 0.152: IC1.6 54.56,27.94 53,29.5 43,29.5 43,10.5 R9.1 32.86,6.86 J14.3 | S2.4 S2.3
N$22
  Top 0.152: IC1.12 60.5,32.56 60.5,20 59.5,19 J61.1 | R10.2 89,60 76.5,60 75.5,59 75.5,46 71.5,46 69,43.5 69,22.5 64,17.5 64,11.5 J62.1
  Bottom 0.152: J61.1 60,18 J62.1
N$25
  Bottom 0.152: Q3.2 9.5,40.4 9.5,40.5 9,41 7.64,41 5.64,43 R17.2
N$27
  Top 0.152: R10.1 74.5,65.5 75,66 Q2.2
  Bottom 0.152: C3.1 75.54,80.46 76.5,79.5 76.5,75.5 75,74 Q2.2
N$28
  Top 0.152: J50.1 50,62 50,66.5 50.5,67 50.5,70.5 43.5,70.5 43,70 43,53.5 38,53.5 37.5,54 J51.1
  Bottom 0.152: J32.1 70,55.5 69,56.5 54,56.5 51,53.5 50,53.5 50,62 J50.1 | J51.1 37.34,54.34 37.34,49 29.5,49 28.5,50 26,50 25,49 19,49 19,51 16.5,51 16.5,65.76 26.49,65.76 29.73,69 34,69 34.01,68.99 J26.2
N$30
  Top 0.152: J43.1 61.5,48 59,48 J44.1 | J14.5 37.94,4.94 42.5,9.5 42.5,18 48.5,18 J3.1
  Bottom 0.152: IC1.8 63.5,23 54,23 54,25.5 52,27.5 48,27.5 48,23 J3.1 51,22.5 52.5,21 67.5,21 67.5,44.5 63.5,48.5 J43.1 J42.1 | J44.1 58,42 52,42 50,40 47.5,42.5 42,42.5 41.75,42.25 41,43 R12.1
N$31
  Bottom 0.152: J46.3 85.3,47.2 J46.2 80.8,44.5 73,44.5 70.5,42 70.5,19 65,19 65,12 67,10 68.5,10 68.5,6 67,4.5 J66.1
N$36
  Bottom 0.152: J63.2 10.25,41.75 11.97,40.03 Q3.3 14.65,38.65 16,40 16,43 17,44 19.5,44 21.5,42 D4.2

### Text on the board
tNames: + | 3.3 VDC | - | CAM / SYNC | 5VIN | + | 5 VDC IN | - | FAN SW | FAN | LED | DIR | Hawkeye II / v1.0 | UP | DOWN
_tNames: 3K | 2.2K | 1K